# EAGLE design usbasp (EAGLE 9.6.0)
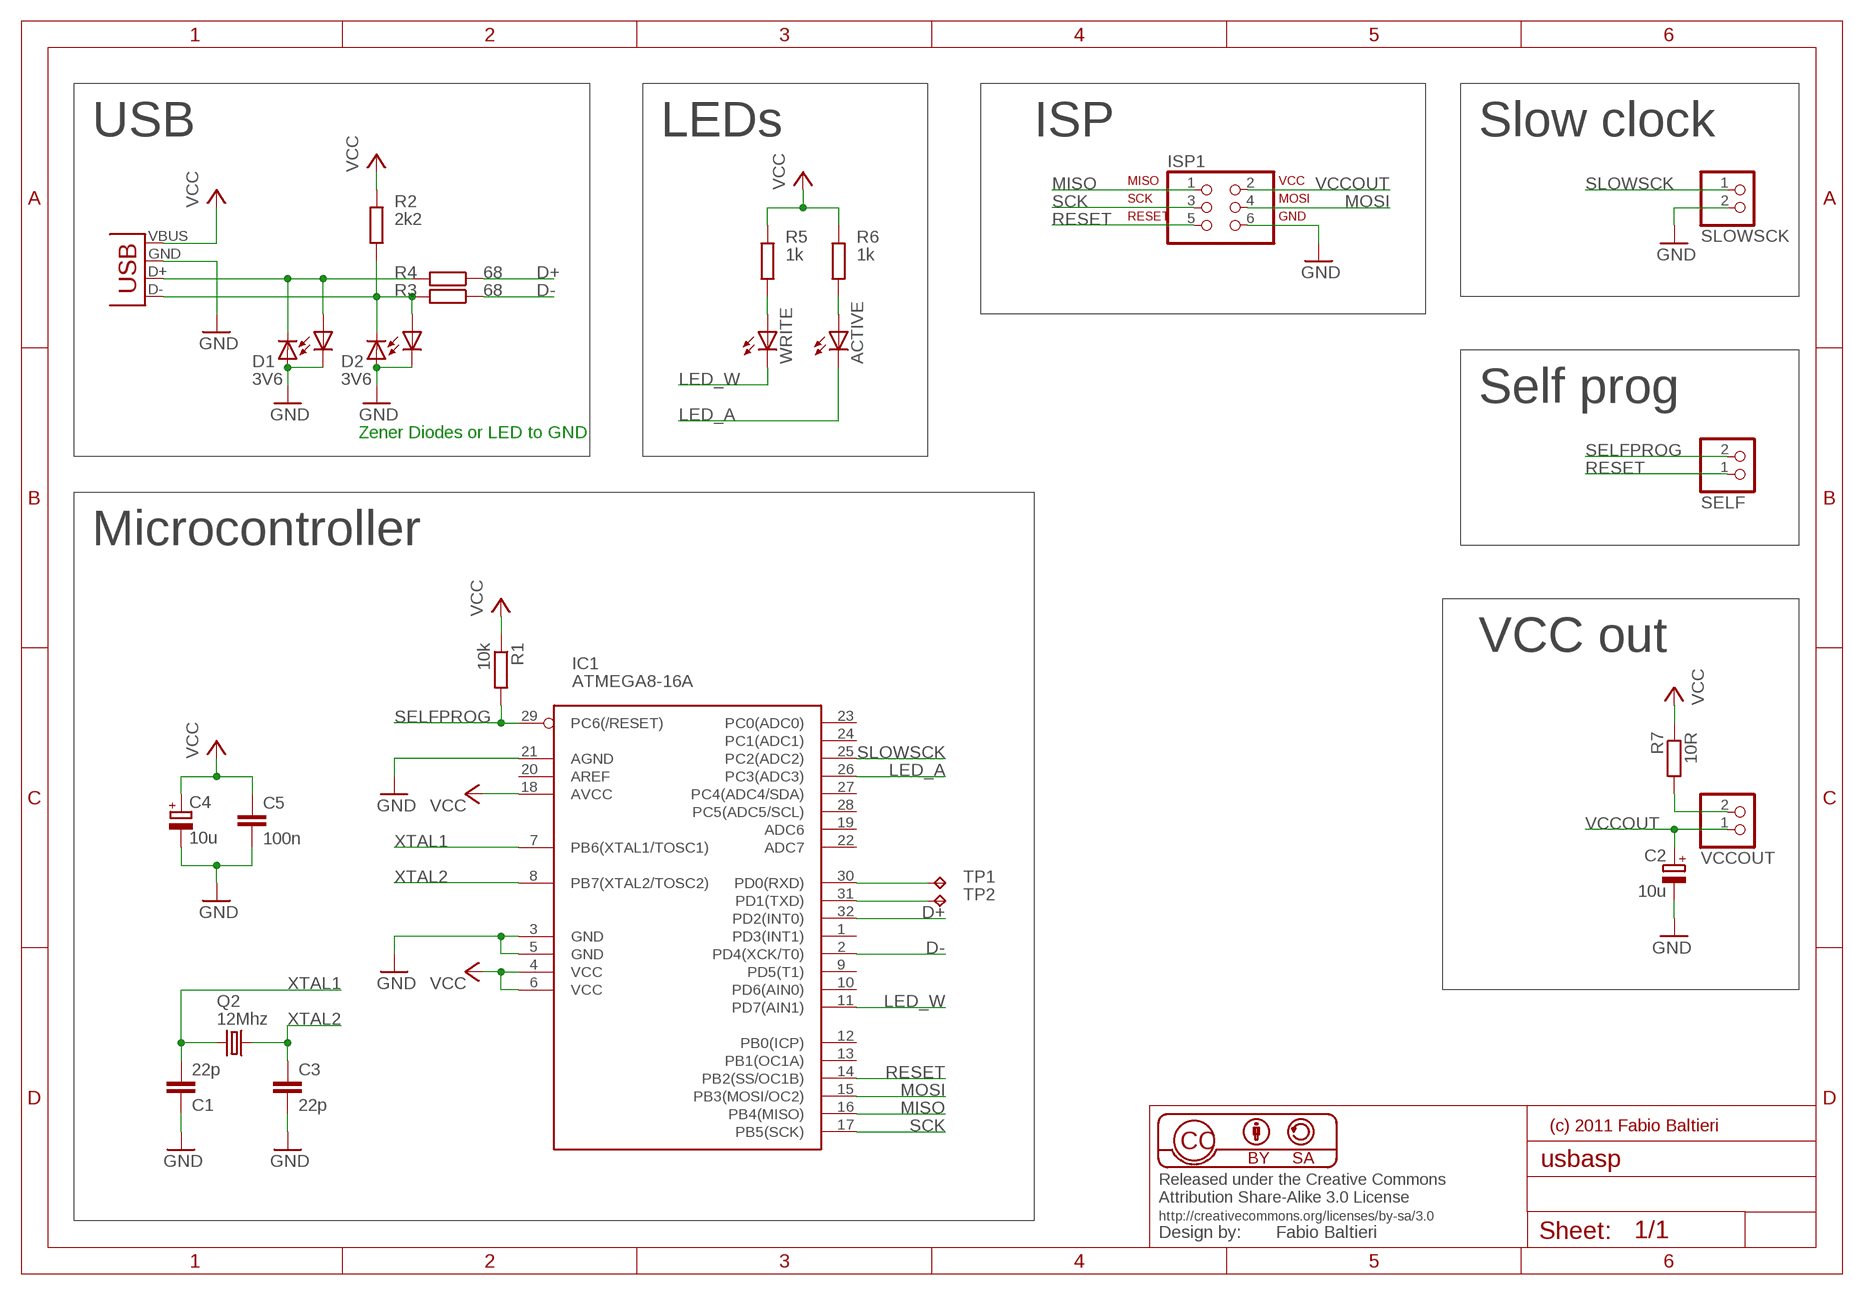
[diagram p0: schematic, sheet 1]

## Parts
ACTIVE  LEDCHIP-LED0805  [CHIP-LED0805]
C1  22p  C-EUC0805  [C0805]
C2  10u  CPOL-EUSMCA  [SMC_A]
C3  22p  C-EUC0805  [C0805]
C4  10u  CPOL-EUSMCA  [SMC_A]
C5  100n  C-EUC0805  [C0805]
D1  3V6  DIODESMA  [SMA-DIODE]
D2  3V6  DIODESMA  [SMA-DIODE]
IC1  ATMEGA8-16A  [TQFP32-08]
ISP1  ISP-AVR910SMD  [2X03_BORDER]
LED1  LEDCHIP-LED0805  [CHIP-LED0805]
LED2  LEDCHIP-LED0805  [CHIP-LED0805]
Q2  12Mhz  CRYSTALHC49US  [HC49US]
R1  10k  R-EU_M0805  [M0805]
R2  2k2  R-EU_M0805  [M0805]
R3  68  R-EU_M0805  [M0805]
R4  68  R-EU_M0805  [M0805]
R5  1k  R-EU_M0805  [M0805]
R6  1k  R-EU_M0805  [M0805]
R7  10R  R-EU_M0805  [M0805]
SELF  PINHD-1X2  [1X02]
SLOWSCK  PINHD-1X2  [1X02]
TP1  TPB1,27  [B1,27]
TP2  TPB1,27  [B1,27]
VCCOUT  PINHD-1X2  [1X02]
WRITE  LEDCHIP-LED0805  [CHIP-LED0805]
X1  USB-A-H  [USB-A-H]

## Nets
D+: IC1.32(PD2(INT0)) R4.1
D-: IC1.2(PD4(XCK/T0)) R3.1
GND [POWER]: C1.1 C2.- C3.1 C4.- C5.2 D1.A D2.A IC1.3(GND) IC1.5(GND) IC1.21(AGND) ISP1.6 LED1.C LED2.C SLOWSCK.2 X1.GND(VBUS)
LED_A: ACTIVE.C IC1.26(PC3(ADC3))
LED_W: IC1.11(PD7(AIN1)) WRITE.C
MISO: IC1.16(PB4(MISO)) ISP1.1
MOSI: IC1.15(PB3(MOSI/OC2)) ISP1.4
N$5: R5.2 WRITE.A
N$6: D1.C LED1.A R4.2 X1.D+(D-)
N$7: D2.C LED2.A R2.1 R3.2 X1.D-(D+)
N$8: ACTIVE.A R6.2
N$9: IC1.30(PD0(RXD)) TP1.TP
N$11 [POWER]: R7.2 VCCOUT.2
N$12: IC1.31(PD1(TXD)) TP2.TP
RESET: IC1.14(PB2(SS/OC1B)) ISP1.5 SELF.1
SCK: IC1.17(PB5(SCK)) ISP1.3
SELFPROG: IC1.29(PC6(/RESET)) R1.2 SELF.2
SLOWSCK: IC1.25(PC2(ADC2)) SLOWSCK.1
VCC [POWER]: C4.+ C5.1 IC1.4(VCC) IC1.6(VCC) IC1.18(AVCC) R1.1 R2.2 R5.1 R6.1 R7.1 X1.VBUS(GND)
VCCOUT [POWER]: C2.+ ISP1.2 VCCOUT.1
XTAL1: C1.2 IC1.7(PB6(XTAL1/TOSC1)) Q2.2
XTAL2: C3.2 IC1.8(PB7(XTAL2/TOSC2)) Q2.1
Unconnected: IC1.1(PD3(INT1)) IC1.9(PD5(T1)) IC1.10(PD6(AIN0)) IC1.12(PB0(ICP)) IC1.13(PB1(OC1A)) IC1.19(ADC6) IC1.20(AREF) IC1.22(ADC7) IC1.23(PC0(ADC0)) IC1.24(PC1(ADC1)) IC1.27(PC4(ADC4/SDA)) IC1.28(PC5(ADC5/SCL))

## Notes on the sheet
- USB | LEDs | ISP | Slow clock
- Self prog
- Zener Diodes or LED to GND
- Microcontroller
- VCC out
- (c) 2011 Fabio Baltieri

## Library data of the parts
ACTIVE LED1 LED2 WRITE = led:LED: LED OSRAM: - CHIPLED LG R971, LG N971, LY N971, LG Q971, LY Q971, LO R971, LY R971 LH N974, LH R974 LS Q976, LO Q976, LY Q976 LO Q996 - Hyper CHIPLED LW Q18S LB Q993, LB Q99A, LB R99A - SideLED LS A670, LO A670, LY A670, LG A670, LP A670 LB A673, LV A673, LT A673, LW A673 LH A674 LY A675 LS A676, LA A676, LO A676, LY A676, LW A676 LS A679, LY A679, LG A679 - Hyper Micro SIDELED® LS Y876, LA Y876, LO Y876, LY Y876 LT Y87S - SmartLED LW L88C, LW L88S LB L89C, LB L89S, LG L890 LS L89K, LO L89K, LY L89K LS L896, LA L896, LO L896, LY L896 - TOPLED LS T670, LO T670, LY T670, LG T670, LP T670 LSG T670, LSP T670, LSY T670, LOP T670, LYG T670 LG T671, LOG T671, LSG T671 LB T673, LV T673, LT T673, LW T673 LH T674 LS T676, LA T676, LO T676, LY T676, LB T676, LH T676, LSB T676, LW T676 LB T67C, LV T67C, LT T67C, LS T67K, LO T67K, LY T67K, LW E67C LS E67B, LA E67B, LO E67B, LY E67B, LB E67C, LV E67C, LT E67C LW T67C LS T679, LY T679, LG T679 LS T770, LO T770, LY T770, LG T770, LP T770 LB T773, LV T773, LT T773, LW T773 LH T774 LS E675, LA E675, LY E675, LS T675 LS T776, LA T776, LO T776, LY T776, LB T776 LHGB T686 LT T68C, LB T68C - Hyper Mini TOPLED® LB M676 - Mini TOPLED Santana® LG M470 LS M47K, LO M47K, LY M47K Source: http://www.osram.convergy.de LUXEON: - LUMILED® LXK2-PW12-R00, LXK2-PW12-S00, LXK2-PW14-U00, LXK2-PW14-V00 LXK2-PM12-R00, LXK2-PM12-S00, LXK2-PM14-U00 LXK2-PE12-Q00, LXK2-PE12-R00, LXK2-PE12-S00, LXK2-PE14-T00, LXK2-PE14-U00 LXK2-PB12-K00, LXK2-PB12-L00, LXK2-PB12-M00, LXK2-PB14-N00, LXK2-PB14-P00, LXK2-PB14-Q00 LXK2-PR12-L00, LXK2-PR12-M00, LXK2-PR14-Q00, LXK2-PR14-R00 LXK2-PD12-Q00, LXK2-PD12-R00, LXK2-PD12-S00 LXK2-PH12-R00, LXK2-PH12-S00 LXK2-PL12-P00, LXK2-PL12-Q00, LXK2-PL12-R00 Source: www.luxeon.com KINGBRIGHT: KA-3528ASYC Source: www.kingbright.com
C1 C3 C5 = rcl:C-EU: CAPACITOR, European symbol
C2 C4 = rcl:CPOL-EU: POLARIZED CAPACITOR, European symbol
D1 D2 = sparkfun:DIODE: Diode These are standard reverse protection diodes and small signal diodes. SMA package can handle up to about 1A. SOD-323 can handle about 200mA. What the SOD-323 package when ordering, there are some mfgs out there that are 5-pin packages.
IC1 = avr:ATMEGA8: MICROCONTROLLER 8 Kbytes FLASH 1 kbytes SRAM 512 bytes EEPROM USART 6-channel 10 bit ADC 2-channel 8 bit ADC
ISP1 = balto:ISP-AVR910: PIN HEADER
Q2 = sparkfun:CRYSTAL: Crystals Various standard crystals. Proven footprints. Spark Fun Electronics SKU : COM-00534
R1-R7 = rcl:R-EU_: RESISTOR, European symbol
SELF SLOWSCK VCCOUT = pinhead:PINHD-1X2: PIN HEADER
TP1 TP2 = testpad:TP: Test pad
X1 = sparkfun:USB: USB Connectors USB-B-PTH is fully proven SKU : PRT-00139 USB-miniB is fully proven SKU : PRT-00587 USB-A-PCB is untested. USB-A-H is throughly reviewed, but untested. Spark Fun Electronics SKU : PRT-00437 USB-B-SMT is throughly reviewed, but untested. Needs silkscreen touching up. USB-A-S has not been used/tested USB-MB-H has not been used/tested

## Net classes
1 POWER: width 0.305 mm

## Board
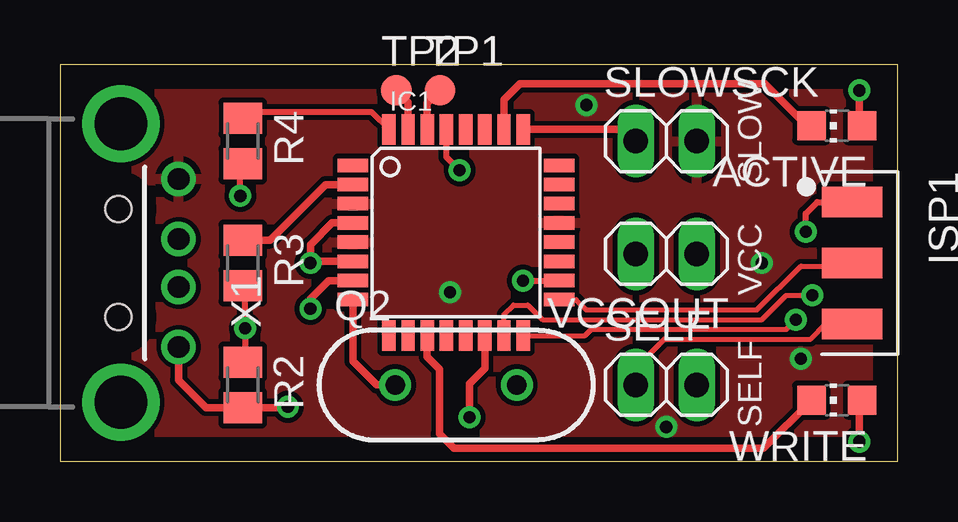
[diagram p1: board, top side]
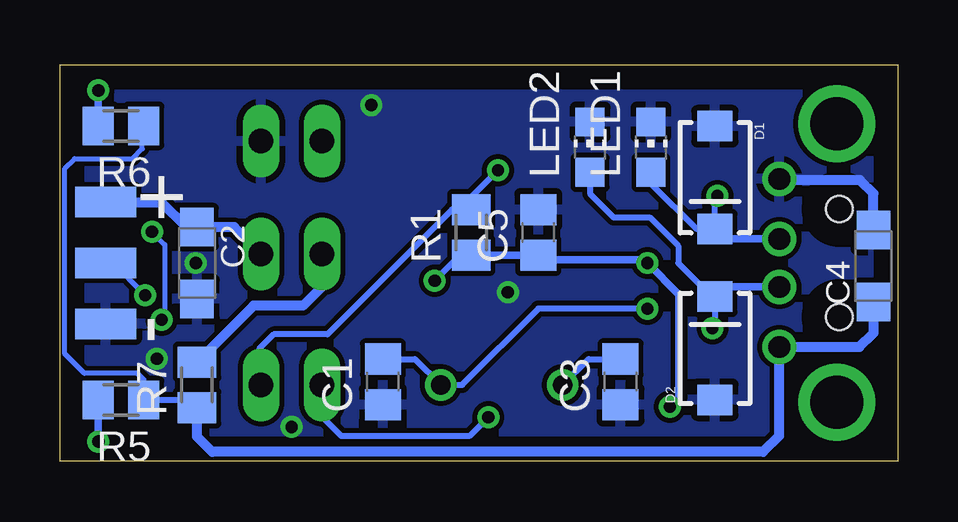
[diagram p2: board, bottom side, seen from below]

Size 34.92 x 16.51 mm. Coordinates in mm from the lower left corner, seen from the top.
Outline: 0,0 34.92,0 34.92,16.51 0,16.51 0,0
Copper layers (1*16): Top 0.035mm / dielectric 1.5mm / Bottom 0.035mm
Design rules "default": minimum track width 10mil, minimum drill 20mil, track to track 8mil, track to pad 8mil, pad to pad 8mil, via to via 8mil, smd to smd 8mil, copper to edge 40mil, drill to drill 8mil, minimum pad ring 10mil, minimum via ring 8mil, stop-mask expansion 4mil, vias tented up to drill 20mil, thermal gap 10mil

### Footprints (pad centres in the part's own frame; a part is rotated, then mirrored left to right if it is on the bottom)
CHIP-LED0805 = smd 1.2 x 1.2: A 0,-1.05; C 0,1.05
C0805 = smd 1.3 x 1.5: 1 -0.95,0; 2 0.95,0
SMC_A = smd 1.6 x 1.4: + -1.5,0; - 1.5,0
SMA-DIODE = smd 1.27 x 1.47: A -2.15,0; C 2.15,0
TQFP32-08 = smd 1.27 x 0.559: 1 -4.293,2.8; 2 -4.293,2; 3 -4.293,1.2; 4 -4.293,0.4; 5 -4.293,-0.4; 6 -4.293,-1.2; 7 -4.293,-2; 8 -4.293,-2.8; 17 4.293,-2.8; 18 4.293,-2; 19 4.293,-1.2; 20 4.293,-0.4; 21 4.293,0.4; 22 4.293,1.2; 23 4.293,2; 24 4.293,2.8 | smd 0.559 x 1.27: 9 -2.8,-4.293; 10 -2,-4.293; 11 -1.2,-4.293; 12 -0.4,-4.293; 13 0.4,-4.293; 14 1.2,-4.293; 15 2,-4.293; 16 2.8,-4.293; 25 2.8,4.293; 26 2,4.293; 27 1.2,4.293; 28 0.4,4.293; 29 -0.4,4.293; 30 -1.2,4.293; 31 -2,4.293; 32 -2.8,4.293
2X03_BORDER = smd 1.27 x 2.54: 1 -2.54,0; 3 0,0; 5 2.54,0 | smd 1.27 x 2.54 bottom: 2 -2.54,0; 4 0,0; 6 2.54,0
HC49US = drill 0.813: 1 -2.54,0; 2 2.54,0
M0805 = smd 1.3 x 1.6: 1 -0.95,0; 2 0.95,0
1X02 = drill 1.016 long: 1 -1.27,0; 2 1.27,0
B1,27 = smd 1.27 x 1.27: TP 0,0
USB-A-H = drill 0.914: D+ 2.4,1; D- 2.4,-1; GND 2.4,3.5; VBUS 2.4,-3.5 | drill 2.2: GND@1 0,5.8; GND@2 0,-5.8 | hole 1.1: -0.1,2.25; -0.1,-2.25

### Placement (x,y rotation side)
ACTIVE  32.38,13.97 90 top
C1  21.46,3.3 90 bottom
C2  29.21,8.26 270 bottom
C3  11.56,3.3 90 bottom
C4  1.02,8.13 90 bottom
C5  14.99,9.53 90 bottom
D1  7.62,11.81 270 bottom
D2  7.62,4.7 90 bottom
IC1  16.51,9.53 0 top
ISP1  33.02,8.26 270 top
LED1  10.29,13.08 0 bottom
LED2  12.83,13.08 0 bottom
Q2  16.51,3.17 0 top
R1  17.78,9.53 90 bottom
R2  7.62,3.17 270 top
R3  7.62,8.26 270 top
R4  7.62,13.34 270 top
R5  32.38,2.54 180 bottom
R6  32.38,13.97 180 bottom
R7  29.21,3.17 90 bottom
SELF  25.27,3.17 0 top
SLOWSCK  25.27,13.34 0 top
TP1  15.85,15.44 0 top
TP2  14.02,15.44 0 top
VCCOUT  25.27,8.64 180 top
WRITE  32.38,2.54 90 top
X1  2.54,8.26 0 top

### Tracks (layer width: path | path; a pad name or v marks a point on that pad's centre or on a via)
D+
  Top 0.254: R4.1 7.87,14.54 12.99,14.54 IC1.32
D-
  Top 0.305: R3.1 8.75,9.21 11.07,11.53 IC1.2
GND  (via drill 0.51)
  Bottom 0.406: X1.GND 4.89,11.71 1.57,11.71 1.02,11.15 C4.-
  other vias: 21.95,14.83 16.26,7.04 25.27,1.42 29.26,8.26 30.89,4.27
  pour Top (isolate 0.203): 0,16.51 34.92,16.51 34.92,0 0,0
  pour Bottom (isolate 0.203): 34.92,0 0,0 0,16.51 34.92,16.51
LED_A
  Top 0.305: ACTIVE.C 31.14,13.97 29.39,15.72 19.18,15.72 18.51,15.06 IC1.26
LED_W
  Top 0.305: WRITE.C 29.33,0.53 16.43,0.53 15.82,1.15 15.82,3.83 15.31,4.34 IC1.11
MISO  (via drill 0.51)
  Top 0.203: IC1.16 21.89,5.23 22.15,5.49 30.28,5.49 v30.68,5.89
  Top 0.254: v31.09,9.55 31.09,10.31 31.57,10.79 ISP1.1
  Bottom 0.203: v30.68,5.89 30.56,6.02 30.56,9.02 v31.09,9.55
MOSI  (via drill 0.51)
  Top 0.203: IC1.15 18.51,6.12 18.9,6.5 19.51,6.5 20.12,5.89 29.26,5.89 30.28,6.91 v31.37,6.91
  Bottom 0.203: ISP1.4 32.72,8.26 v31.37,6.91
N$5  (via drill 0.51)
  Top 0.305: WRITE.A 33.33,2.43 v33.33,0.81
  Bottom 0.305: v33.33,0.81 33.33,2.53 R5.2
N$6  (via drill 0.51)
  Top 0.254: v7.52,11.05 7.52,12.28 R4.2
  Bottom 0.254: 7.21,9.26 D1.C | D1.C 8.38,9.66 10.29,11.57 LED1.A | D1.C 7.62,10.95 v7.52,11.05
  Bottom 0.305: X1.D+ 7.21,9.26
N$7  (via drill 0.51)
  Top 0.254: R3.2 7.72,7.2 v7.72,5.54 7.72,4.23 R2.1
  Bottom 0.254: 7.21,7.25 D2.C | D2.C 7.62,5.64 v7.72,5.54 | LED2.A 12.83,11.14 11.85,10.16 10.34,10.16 9.14,8.97 9.14,8.25 7.75,6.85 D2.C
  Bottom 0.305: X1.D- 7.21,7.25
N$8  (via drill 0.51)
  Top 0.305: v33.33,15.44 33.33,14.08 ACTIVE.A
  Bottom 0.305: v33.33,15.44 33.33,13.98 R6.2
N$9
  Top 0.305: IC1.30 15.31,14.9 TP1.TP
N$11
  Bottom 0.406: VCCOUT.2 24,7.26 24.79,6.48 26.86,6.48 R7.2
N$12
  Top 0.305: IC1.31 14.51,14.95 TP2.TP
RESET  (via drill 0.51)
  Top 0.203: SELF.1 24,3.89 25.2,5.08 31.29,5.08 31.93,5.71 ISP1.5
  Top 0.305: v17.07,1.83 17.07,3.23 17.71,3.87 IC1.14
  Bottom 0.254: SELF.1 24,1.85 23.19,1.04 17.86,1.04 v17.07,1.83
SCK
  Top 0.203: IC1.17 21.52,6.72 21.95,6.3 29.06,6.3 30.89,8.13 32.89,8.13 ISP1.3
SELFPROG  (via drill 0.51)
  Top 0.254: IC1.29 16.11,12.67 v16.66,12.12
  Bottom 0.254: v16.66,12.12 17.78,11 R1.2 18.58,10.47 23.77,5.28 26.01,5.28 26.62,4.67 26.62,3.25 SELF.2
SLOWSCK
  Top 0.305: IC1.25 23.52,13.82 SLOWSCK.1
VCC  (via drill 0.51)
  Top 0.254: v19.3,7.52 20.8,7.52 IC1.18
  Top 0.305: IC1.6 10.51,8.32 v10.44,8.26 10.44,9.02 11.35,9.93 IC1.4 | X1.VBUS 4.94,3.38 6.09,2.23 R2.2 9.46,2.23 v9.5,2.26
  Bottom 0.203: R5.1 31.43,3.39 31.7,3.66 33.91,3.66 34.72,4.47 34.72,12.19 34.31,12.6 31.9,12.6 31.5,13.01 31.5,13.91 R6.1
  Bottom 0.254: R1.1 18.25,8.57 v19.3,7.52 | R5.1 29.52,2.54 R7.1
  Bottom 0.305: v9.5,2.26 9.12,2.64 9.12,6.93 v10.44,8.26 10.57,8.38 14.79,8.38 C5.1 R1.1
  Bottom 0.406: C4.+ 1.02,5.33 1.59,4.75 X1.VBUS 4.94,1.05 5.61,0.38 28.57,0.38 29.21,1.02 R7.1
VCCOUT
  Bottom 0.406: VCCOUT.1 27.66,9.75 C2.+ 29.67,9.76 30.68,10.77 32.99,10.77 ISP1.2
XTAL1  (via drill 0.51)
  Top 0.305: IC1.7 11.2,7.53 10.44,6.76 v10.44,6.35
  Bottom 0.254: v10.44,6.35 14.99,6.35 18.16,3.17 Q2.2 20.13,4.25 C1.2
XTAL2
  Top 0.305: Q2.1 13.21,3.17 12.22,4.17 IC1.8
  Bottom 0.254: C3.2 12.89,4.25 Q2.1

### Text on the board
tSilk: SLOW | VCC | SELF
bSilk: + | -